# EAGLE design Branch_Left (EAGLE 7.4.0)
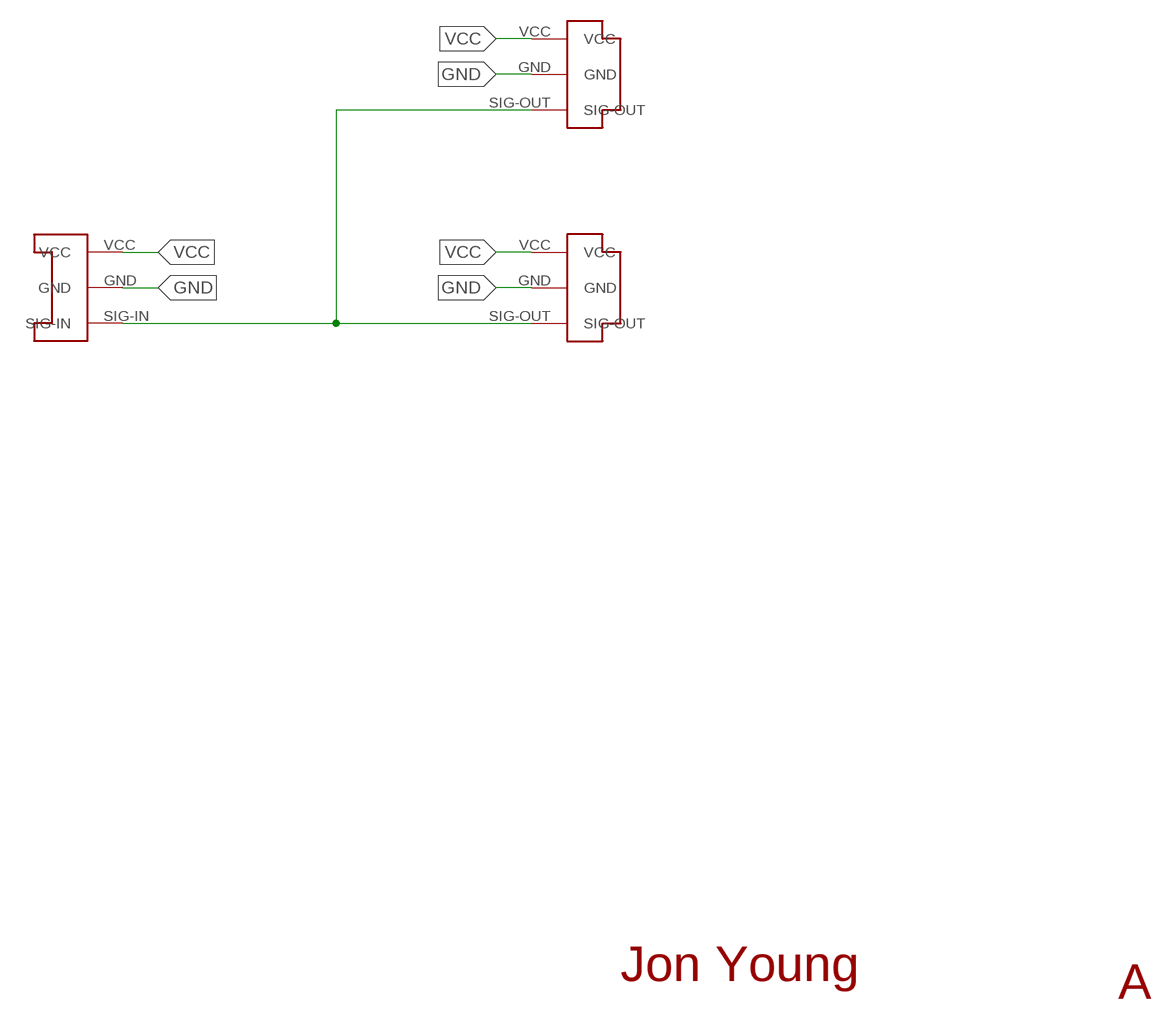
[diagram p0: schematic, sheet 1]

## Parts
U$1  CONN-PLUG-3POS-3MM  [PLUG-3POS-3MM-SMD]
U$2  CONN-SOCKET-3POS-3MM  [SOCKET-3POS-3MM-SMD]
U$4  CONN-PLUG-3POS-3MM  [PLUG-3POS-3MM-SMD]

## Nets
GND: U$1.GND U$2.GND U$4.GND
VCC: U$1.VCC U$2.VCC U$4.VCC
Y: U$1.SIG-OUT U$2.SIG-IN U$4.SIG-OUT

## Notes on the sheet
- Jon Young
- A

## Library data of the parts
U$1 U$4 = EmbeddedPlayground:CONN-PLUG-3POS-3MM: Surface mount board to board connector. Female socket, 3 position.
U$2 = EmbeddedPlayground:CONN-SOCKET-3POS-3MM: Surface mount board to board connector. Female socket, 3 position.

## Board
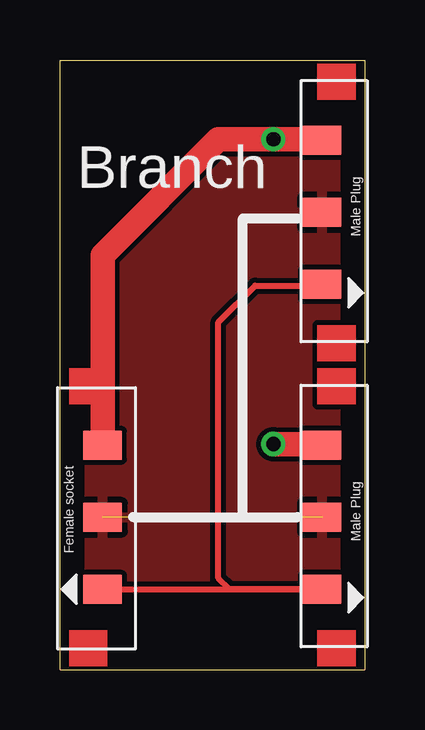
[diagram p1: board, top side]
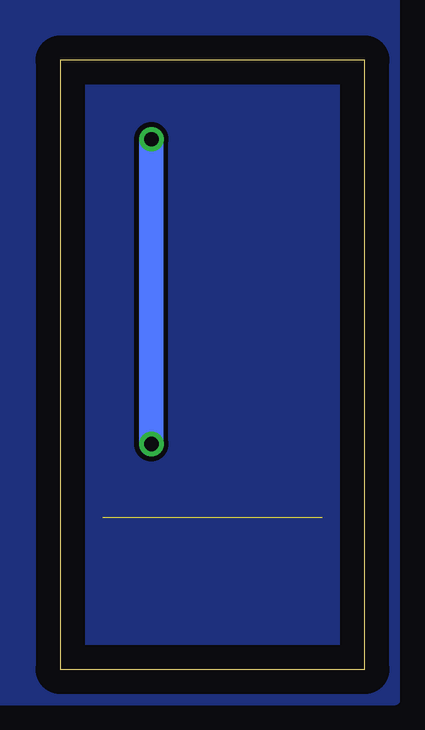
[diagram p2: board, bottom side, seen from below]

Size 12.7 x 25.4 mm. Coordinates in mm from the lower left corner, seen from the top.
Outline: 0,0 12.7,0 12.7,25.4 0,25.4 0,0
Copper layers (1*16): Top 0.035mm / dielectric 1.5mm / Bottom 0.035mm
Design rules "default": minimum track width 10mil, minimum drill 24mil, track to track 8mil, track to pad 8mil, pad to pad 8mil, via to via 8mil, smd to smd 8mil, copper to edge 40mil, drill to drill 8mil, minimum pad ring 10mil, minimum via ring 8mil, stop-mask expansion 4mil, vias tented up to drill 0mil, thermal gap 10mil

### Footprints (pad centres in the part's own frame; a part is rotated, then mirrored left to right if it is on the bottom)
PLUG-3POS-3MM-SMD = smd 1.2 x 1.6: GND 0,0; SIG-OUT 3,0; VCC -3,0
SOCKET-3POS-3MM-SMD = smd 1.2 x 1.6: GND 0,0; SIG-IN -3,0; VCC 3,0

### Placement (x,y rotation side)
U$1  10.92,6.35 270 top
U$2  1.78,6.35 90 top
U$4  10.92,19.05 270 top

### Tracks (layer width: path | path; a pad name or v marks a point on that pad's centre or on a via)
GND  (1 unrouted)
  pour Top: -1.27,31.69 -1.27,-1.27 16.42,-1.27 16.42,31.69
  pour Bottom: -1.27,31.69 16.42,31.69 16.42,-1.27 -1.27,-1.27
N$7
  Top 0.254: 10.92,16.26 10.92,16
VCC  (via drill 0.6)
  Top 1.016: U$4.VCC 10.87,22.1 v8.89,22.1 6.6,22.1 1.78,17.27 U$2.VCC | v8.89,9.4 10.87,9.4 U$1.VCC
  Bottom 1.016: v8.89,9.4 v8.89,22.1
Y
  Top 0.254: 10.87,3.3 U$1.SIG-OUT | U$2.SIG-IN U$1.SIG-OUT | U$1.SIG-OUT 7.06,3.35 6.6,3.81 6.6,14.48 8.13,16 10.87,16 U$4.SIG-OUT

### Text on the board
tPlace: Branch